# Altium schematic sheet Psyduck.SchDoc
size A4
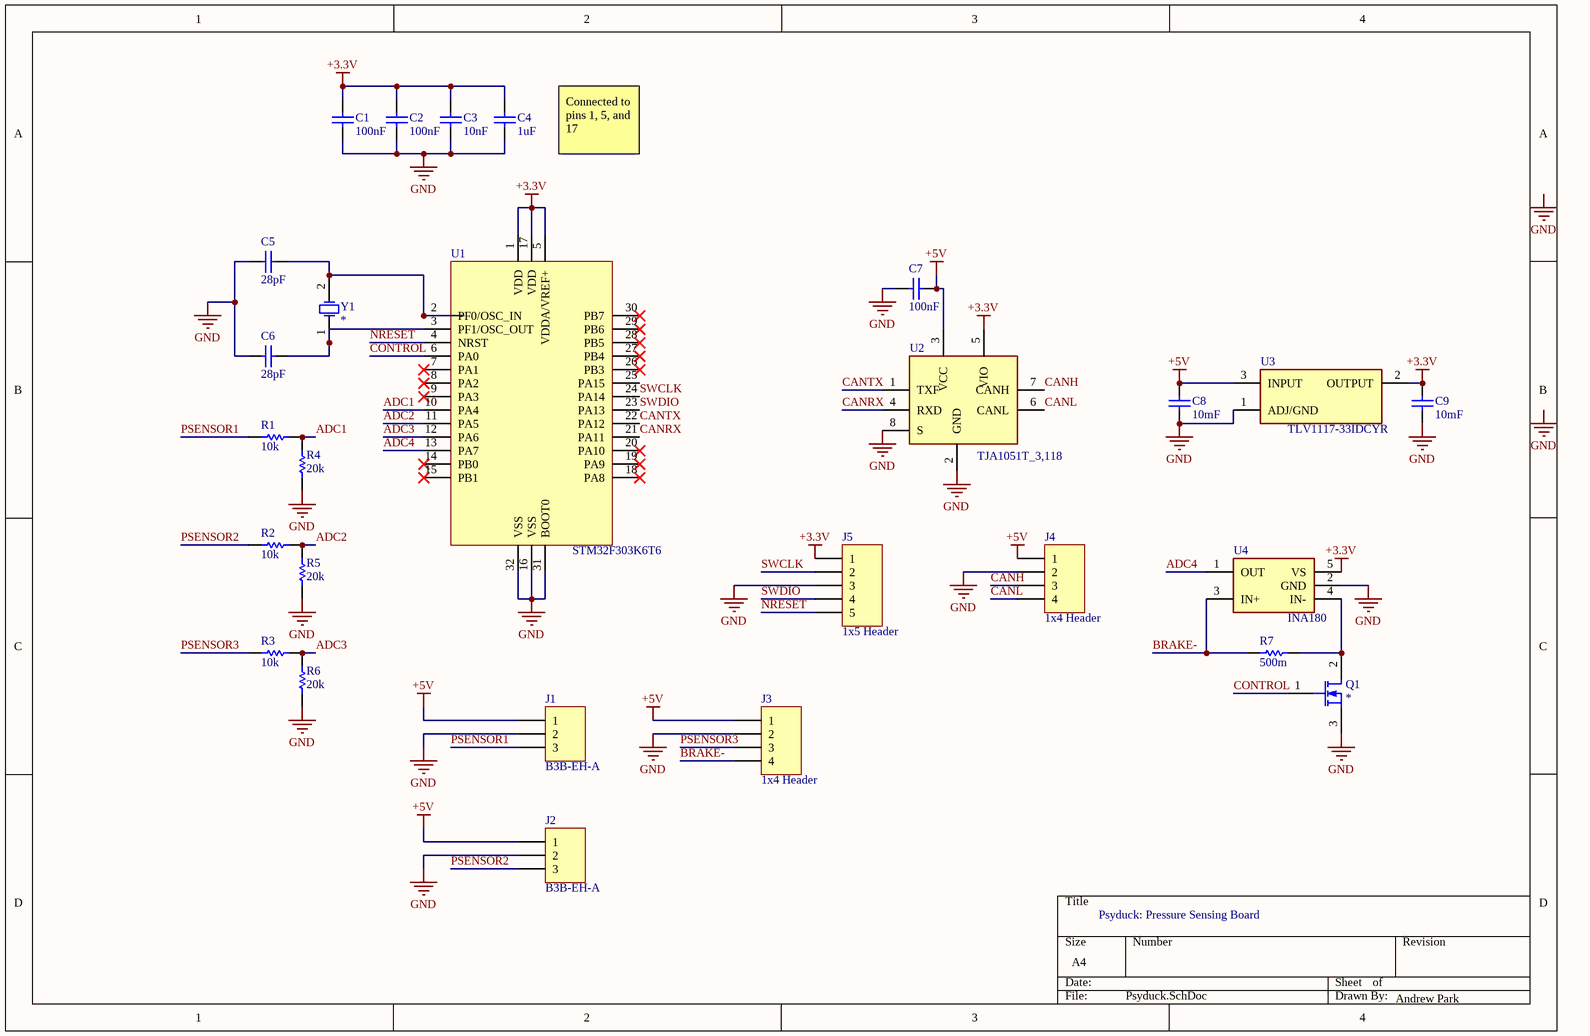
[diagram p0: Psyduck.SchDoc]

## Parts
C1  value 100nF  [0805 - Capacitor]  (hidden comment: Capacitor - Nonpolarized)
C2  value 100nF  [0805 - Capacitor]  (hidden comment: Capacitor - Nonpolarized)
C3  value 10nF  [0805 - Capacitor]  (hidden comment: Capacitor - Nonpolarized)
C4  value 1uF  [0805 - Capacitor]  (hidden comment: Capacitor - Nonpolarized)
C5  value 28pF  [0805 - Capacitor]  (hidden comment: Capacitor - Nonpolarized)
C6  value 28pF  [0805 - Capacitor]  (hidden comment: Capacitor - Nonpolarized)
C7  value 100nF  [0805 - Capacitor]  (hidden comment: Capacitor - Nonpolarized)
C8  value 10mF  [0805 - Capacitor]  (hidden comment: Capacitor - Nonpolarized)
C9  value 10mF  [0805 - Capacitor]  (hidden comment: Capacitor - Nonpolarized)
J1  B3B-EH-A  [B3B-XH]
J2  B3B-EH-A  [B3B-XH]
J3  1x4 Header  [B4B-XH]
J4  1x4 Header  [B4B-XH]
J5  1x5 Header  [HDR1X5]
Q1  MOSFET-N  [SC70/SOT323]  (value not drawn)
R1  value 10k  [0603 - Resistor]  (hidden comment: Resistor)
R2  value 10k  [0603 - Resistor]  (hidden comment: Resistor)
R3  value 10k  [0603 - Resistor]  (hidden comment: Resistor)
R4  value 20k  [0603 - Resistor]  (hidden comment: Resistor)
R5  value 20k  [0603 - Resistor]  (hidden comment: Resistor)
R6  value 20k  [0603 - Resistor]  (hidden comment: Resistor)
R7  value 500m  [0603 - Resistor]  (hidden comment: Resistor)
U1  STM32F303K6T6  [QFP80P900X900X160-32N]
U2  TJA1051T_3,118  [TJA1051T/3,118]
U3  TLV1117-33IDCYR  [TLV1117]
U4  INA180  [INA180]
Y1  Oscillator  [2-SMD NO LEAD CRSYSTAL]  (value not drawn)

## Nets
+3.3V: C1.2 C2.2 C3.2 C4.2 C9.2 J5.1 U1.1(VDD) U1.5(VDDA/VREF+) U1.17(VDD) U2.5(VIO) U3.2(OUTPUT) U4.5(VS)
+5V: C7.2 C8.2 J1.1 J2.1 J3.1 J4.1 U2.3(VCC) U3.3(INPUT)
GND: C1.1 C2.1 C3.1 C4.1 C5.1 C6.1 C7.1 C8.1 C9.1 J1.2 J2.2 J3.2 J4.2 J5.3 Q1.3(S) R4.1 R5.1 R6.1 U1.16(VSS) U1.31(BOOT0) U1.32(VSS) U2.2(GND) U2.8(S) U3.1(ADJ/GND) U4.2(GND)
ADC1: R1.2 R4.2 U1.10(PA4)
ADC2: R2.2 R5.2 U1.11(PA5)
ADC3: R3.2 R6.2 U1.12(PA6)
ADC4: U1.13(PA7) U4.1(OUT)
BRAKE-: J3.4 R7.2 U4.3(IN+)
CANH: J4.3 U2.7(CANH)
CANL: J4.4 U2.6(CANL)
CANRX: U1.21(PA11) U2.4(RXD)
CANTX: U1.22(PA12) U2.1(TXF)
CONTROL: Q1.1(G) U1.6(PA0)
NRESET: J5.5 U1.4(NRST)
PSENSOR1: J1.3 R1.1
PSENSOR2: J2.3 R2.1
PSENSOR3: J3.3 R3.1
SWCLK: J5.2 U1.24(PA14)
SWDIO: J5.4 U1.23(PA13)
NetC5_2: C5.2 U1.2(PF0/OSC_IN) Y1.2(OSC2)
NetC6_2: C6.2 U1.3(PF1/OSC_OUT) Y1.1(OSC1)
NetQ1_2: Q1.2(D) R7.1 U4.4(IN-)

Not connected (* = marked no-connect by the designer): U1 7(PA1)* 8(PA2)* 9(PA3)* 14(PB0)* 15(PB1)* 18(PA8)* 19(PA9)* 20(PA10)* 25(PA15) 26(PB3)* 27(PB4)* 28(PB5)* 29(PB6)* 30(PB7)*

## Notes on the sheet
- Connected to pins 1, 5, and 17
- Psyduck: Pressure Sensing Board
- Andrew Park
- Labels drawn without touching a wire or pin: GND

## Library data of the parts
C1-C9 = Capacitor - Nonpolarized: Nonpolarized Capacitor; Supplier Part Number: *; Supplier: *; Manufacturer: *; Rating: *; Manufacturer Part Number: *
J1 J2 = 1x3 Header: 1x3 Pin Header
J3 J4 = 1x4 Header: 1x4 Pin Header
J5 = 1x5 Header: 1x5 Pin Header
Q1 = MOSFET-N: N-Channel MOSFET; Supplier: *; Manufacturer Part Number: *; Supplier Part Number: *; Rating: *; Manufacturer: *; Value: *
U1 = STM32F303K6T6: Integrated Circuit
U2 = TJA1051T_3,118: CAN Transceiver IC 4.5V-5.5V 250ns; Manufacturer: NXP; Datasheet: http://www.nxp.com/docs/en/data-sheet/TJA1051.pdf; Manufacturer Part Number: TJA1051T/3,118; Supplier Part Number: 568-8684-1-ND; Supplier: Digikey
U3 = TLV1117-33IDCYR: Linear Voltage Regulator IC 3.3V 800MA SOT223-4; Manufacturer: Texas Instruments; Datasheet: http://www.ti.com/lit/ds/symlink/tlv1117.pdf?HQS=TI-null-null-digikeymode-df-pf-null-wwe&ts=1590668900314; Manufacturer Part Number: TLV1117-33IDCYR; Supplier Part Number: 296-21112-1-ND; Supplier: Digikey
U4 = INA180: 0V to 26V Current Sense Amplifier; Manufacturer: Texas Instruments; Manufacturer Part Number: INA180A2IDBVR; Datasheet: https://www.ti.com/lit/ds/symlink/ina180.pdf; Supplier Part Number: 296-47653-1-ND; Supplier: Digikey
Y1 = Oscillator: Crystal Oscillator; Manufacturer Part Number: *; Manufacturer: *; Supplier Part Number: *; Supplier: *; Rating: *; Value: *
R1-R7 = Resistor: Rating: *; Manufacturer Part Number: *; Manufacturer: *; Supplier Part Number: *; Supplier: *